# EAGLE design Master_board (EAGLE 8.4.1)
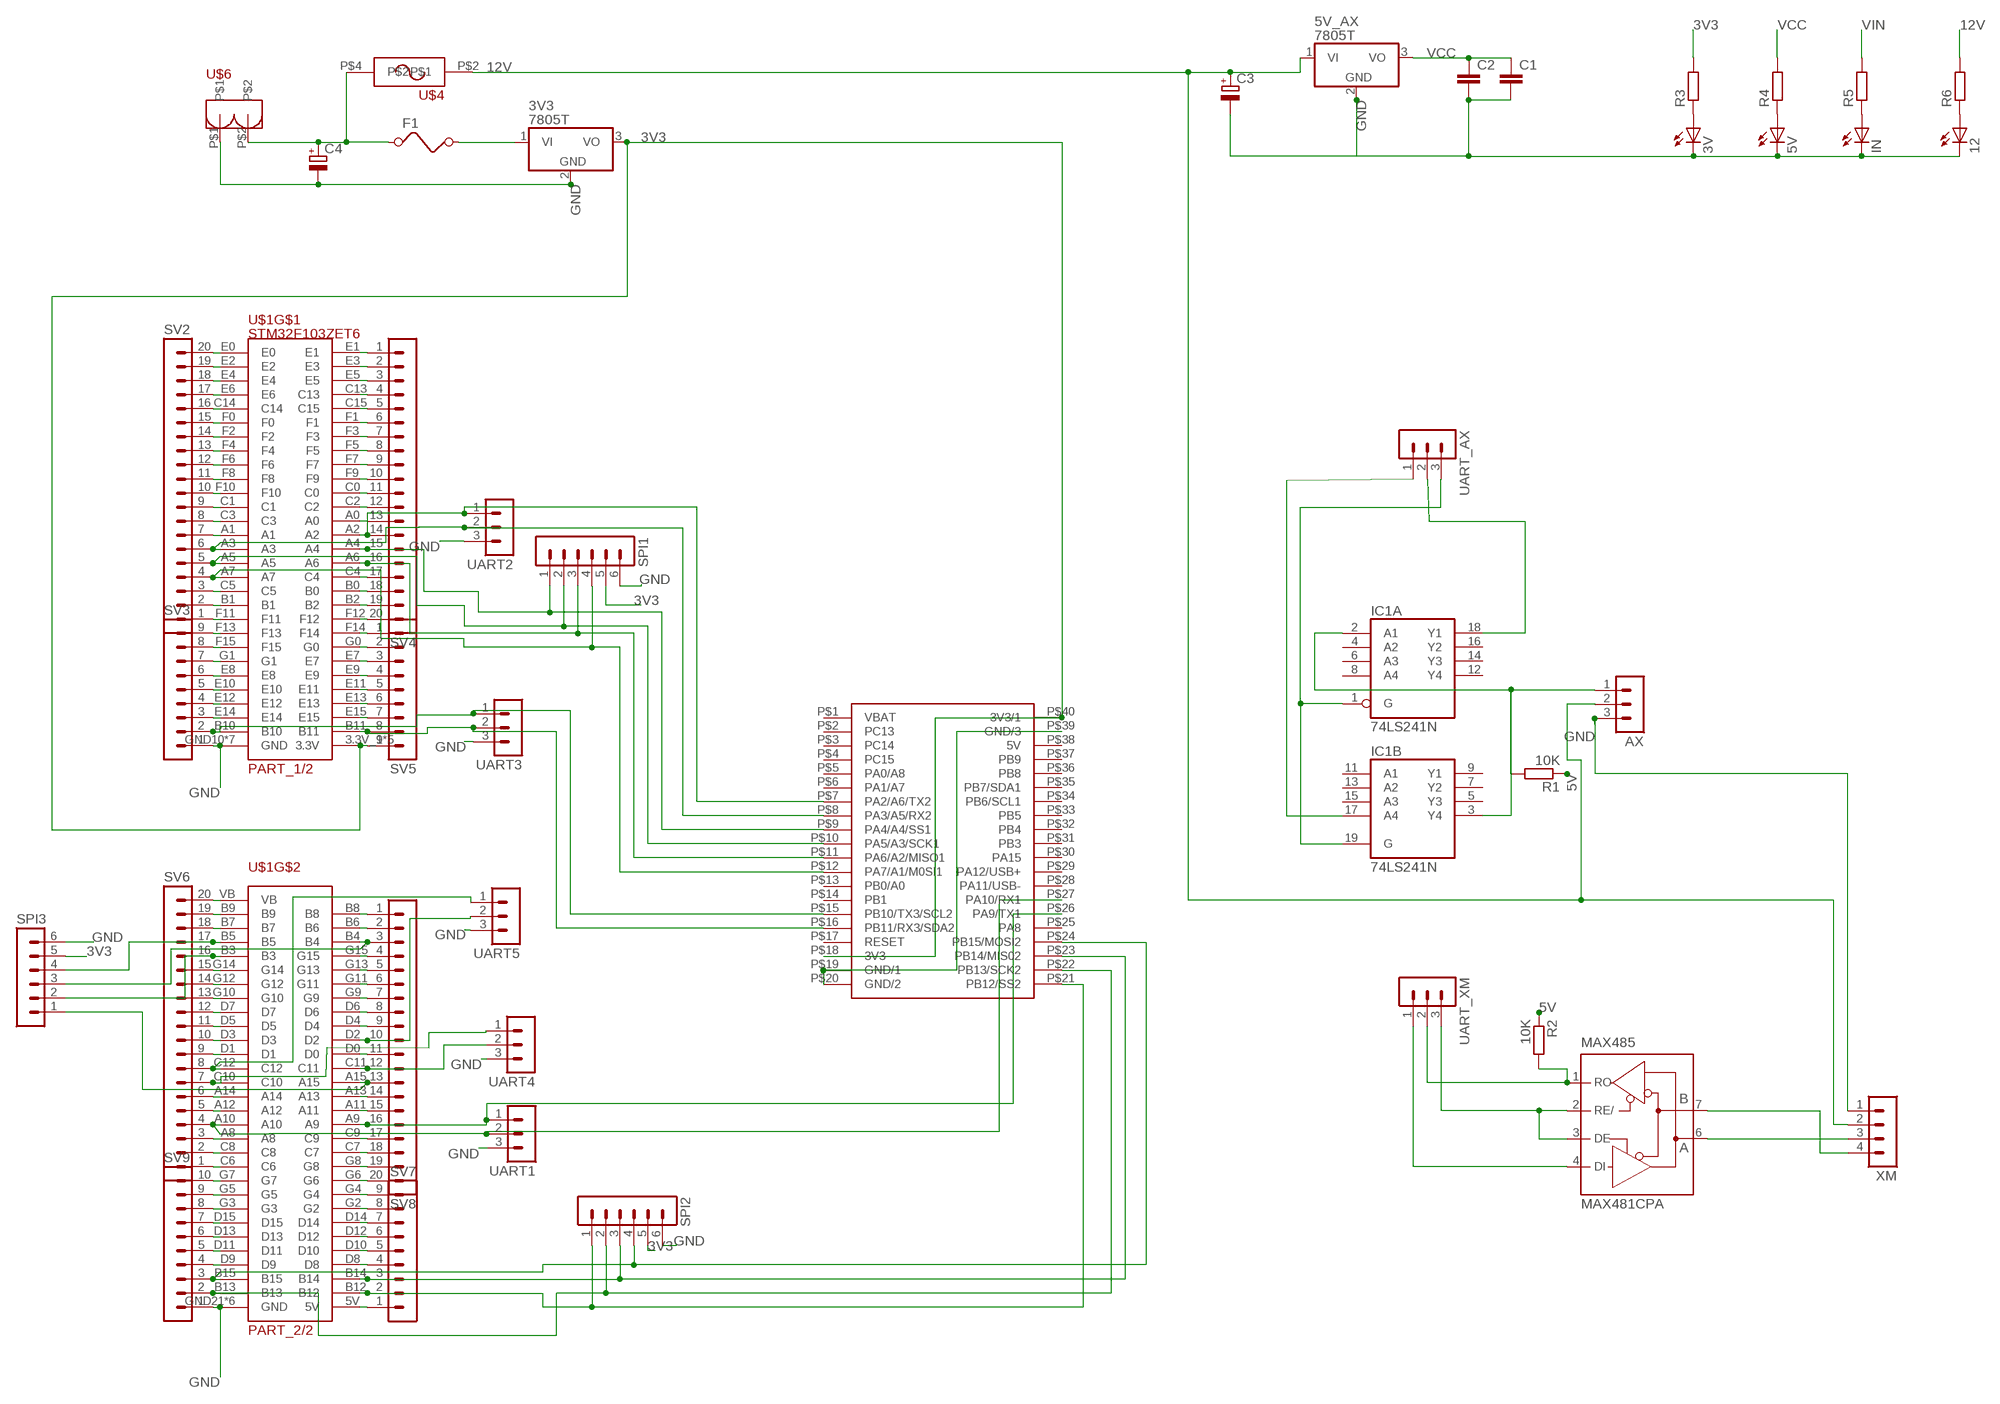
[diagram p0: schematic, sheet 1]

## Parts
3V  LED_ELD260  [LED_LD260]
3V3  7805T  [TO220H]
5V  LED_ELD260  [LED_LD260]
5V_AX  7805T  [TO220H]
12  LED_ELD260  [LED_LD260]
AX  MA03-1  [MA03-1]
C1  C-EU025-024X044  [C025-024X044]
C2  C-EU025-024X044  [C025-024X044]
C3  CPOL-EUE5-10.5  [E5-10,5]
C4  CPOL-EUE5-10.5  [E5-10,5]
F1  FUSE  [FUSE]
IC1  74LS241N  [DIL20]
IN  LED_ELD260  [LED_LD260]
MAX485  MAX481CPA  [DIL08]
R1  10K  R-EU_0309/12  [0309/12]
R2  10K  R-EU_0309/12  [0309/12]
R3  R-EU_0204/5  [0204/5]
R4  R-EU_0204/5  [0204/5]
R5  R-EU_0204/5  [0204/5]
R6  R-EU_0204/5  [0204/5]
SPI1  MA06-1  [MA06-1]
SPI2  MA06-1  [MA06-1]
SPI3  MA06-1  [MA06-1]
SV2  MA20-1L  [MA20-1L]
SV3  MA09-1  [MA09-1]
SV4  MA20-1L  [MA20-1L]
SV5  MA09-1  [MA09-1]
SV6  MA20-1L  [MA20-1L]
SV7  MA09-1  [MA09-1]
SV8  MA20-1L  [MA20-1L]
SV9  MA10-1  [MA10-1]
U$1  M32F103ZET6_DEV_BOARD  [STM32F103ZET6_DEV_BOARD]
U$2  BLUEPILL  [BLUEPILL]
U$4  AUTO_FUSE  [AUTO_FUSE]
U$6  GREEN_HEADER  [GREEN_HEADER]
UART1  MA03-1  [MA03-1]
UART2  MA03-1  [MA03-1]
UART3  MA03-1  [MA03-1]
UART4  MA03-1  [MA03-1]
UART5  MA03-1  [MA03-1]
UART_AX  MA03-1  [MA03-1]
UART_XM  MA03-1  [MA03-1]
XM  MA04-1  [MA04-1]

## Nets
3V3: 3V3.3(VO) R3.2 SPI1.5 SPI2.5 SPI3.5 SV5.9 U$1.3.3V_1(3.3V) U$1.3.3V_2(3.3V) U$1.3.3V_3(3.3V) U$1.3.3V_4(3.3V) U$1.3.3V_5(3.3V) U$2.P$18(3V3) U$2.P$40(3V3/1)
5V: R1.1 R2.1
12V: 5V_AX.1(VI) AX.2 C3.+ R6.2 U$4.P$2 XM.2
CTRL_AX: IC1.1(A:G) IC1.19(B:G) UART_AX.3
CTRL_XM: MAX485.2(RE/) MAX485.3(DE) UART_XM.3
D+: MAX485.6(A) XM.3
D-: MAX485.7(B) XM.4
DATA_AX: AX.1 IC1.2(A:A1) IC1.3(B:Y4) R1.2
GND: 3V3.2(GND) 3V.K(C) 5V.K(C) 5V_AX.2(GND) 12.K(C) AX.3 C1.2 C2.2 C3.- C4.- IN.K(C) SPI1.6 SPI2.6 SPI3.6 SV3.1 SV9.1 U$1.GND10(GND) U$1.GND11(GND) U$1.GND12(GND) U$1.GND13(GND) U$1.GND14(GND) U$1.GND15(GND) U$1.GND16(GND) U$1.GND21(GND) U$1.GND22(GND) U$1.GND24(GND) U$1.GND25(GND) U$1.GND26(GND) U$1.GND_20(GND) U$2.P$19(GND/1) U$2.P$20(GND/2) U$2.P$39(GND/3) U$6.P$1 UART1.3 UART2.3 UART3.3 UART4.3 UART5.3 XM.1
MISO1: SPI1.3 SV4.16 U$1.A6 U$2.P$11(PA6/A2/MISO1)
MISO2: SPI2.3 SV7.3 U$1.B14 U$2.P$23(PB14/MIS02)
MISO3: SPI3.3 SV8.3 U$1.B4
MOSI1: SPI1.4 SV2.4 U$1.A7 U$2.P$12(PA7/A1/M0SI1)
MOSI2: SPI2.4 SV9.3 U$1.B15 U$2.P$24(PB15/MOSI2)
MOSI3: SPI3.4 SV6.17 U$1.B5
N$1: 3V.A R3.1
N$2: 5V.A R4.1
N$3: IN.A R5.1
N$4: 12.A R6.1
N$6: SV2.1 U$1.F11
N$26: SV2.2 U$1.B1
N$27: SV2.3 U$1.C5
N$29: SV2.7 U$1.A1
N$30: SV2.8 U$1.C3
N$31: SV2.9 U$1.C1
N$32: SV2.10 U$1.F10
N$33: SV2.11 U$1.F8
N$34: SV2.12 U$1.F6
N$35: SV2.13 U$1.F4
N$36: SV2.14 U$1.F2
N$37: SV2.15 U$1.F0
N$38: SV2.16 U$1.C14
N$39: SV2.17 U$1.E6
N$40: SV2.18 U$1.E4
N$41: SV2.19 U$1.E2
N$42: SV2.20 U$1.E0
N$44: SV3.3 U$1.E14
N$45: SV3.4 U$1.E12
N$46: SV3.5 U$1.E10
N$47: SV3.6 U$1.E8
N$48: SV3.7 U$1.G1
N$49: SV3.8 U$1.F15
N$50: SV3.9 U$1.F13
N$51: SV4.1 U$1.E1
N$52: SV4.2 U$1.E3
N$53: SV4.3 U$1.E5
N$54: SV4.4 U$1.C13
N$55: SV4.5 U$1.C15
N$56: SV4.6 U$1.F1
N$57: SV4.7 U$1.F3
N$58: SV4.8 U$1.F5
N$59: SV4.9 U$1.F7
N$60: SV4.10 U$1.F9
N$61: SV4.11 U$1.C0
N$62: SV4.12 U$1.C2
N$63: SV4.13 U$1.A0
N$64: SV4.17 U$1.C4
N$65: SV4.18 U$1.B0
N$66: SV4.19 U$1.B2
N$67: SV4.20 U$1.F12
N$68: SV5.1 U$1.F14
N$69: SV5.2 U$1.G0
N$70: SV5.3 U$1.E7
N$71: SV5.4 U$1.E9
N$72: SV5.5 U$1.E11
N$73: SV5.6 U$1.E13
N$74: SV5.7 U$1.E15
N$76: SV6.1 U$1.C6
N$77: SV6.2 U$1.C8
N$78: SV6.3 U$1.A8
N$79: SV6.5 U$1.A12
N$80: SV6.6 U$1.A14
N$81: SV6.9 U$1.D1
N$82: SV6.10 U$1.D3
N$83: SV6.11 U$1.D5
N$84: SV6.12 U$1.D7
N$85: SV6.13 U$1.G10
N$86: SV6.14 U$1.G12
N$87: SV6.15 U$1.G14
N$88: SV6.18 U$1.B7
N$89: SV6.19 U$1.B9
N$90: SV6.20 U$1.VB
N$91: SV7.1 U$1.5V
N$92: SV7.4 U$1.D8
N$93: SV7.5 U$1.D10
N$94: SV7.6 U$1.D12
N$95: SV7.7 U$1.D14
N$96: SV7.8 U$1.G2
N$97: SV7.9 U$1.G4
N$98: SV8.1 U$1.B8
N$99: SV8.2 U$1.B6
N$100: SV8.4 U$1.G15
N$101: SV8.5 U$1.G13
N$102: SV8.6 U$1.G11
N$103: SV8.7 U$1.G9
N$104: SV8.8 U$1.D6
N$105: SV8.9 U$1.D4
N$106: SV8.11 U$1.D0
N$107: SV8.14 U$1.A13
N$108: SV8.15 U$1.A11
N$109: SV8.17 U$1.C9
N$110: SV8.18 U$1.C7
N$111: SV8.19 U$1.G8
N$112: SV8.20 U$1.G6
N$114: SV9.4 U$1.D9
N$115: SV9.5 U$1.D11
N$116: SV9.6 U$1.D13
N$117: SV9.7 U$1.D15
N$118: SV9.8 U$1.G3
N$119: SV9.9 U$1.G5
N$120: SV9.10 U$1.G7
N$121: 3V3.1(VI) F1.2
NSS1: SPI1.1 SV4.15 U$1.A4 U$2.P$9(PA4/A4/SS1)
NSS2: SPI2.1 SV7.2 U$1.B12 U$2.P$21(PB12/SS2)
NSS3: SPI3.1 SV8.13 U$1.A15
RX1: SV6.4 U$1.A10 U$2.P$27(PA10/RX1) UART1.2
RX2: SV2.6 U$1.A3 U$2.P$8(PA3/A5/RX2) UART2.2
RX3: SV5.8 U$1.B11 U$2.P$16(PB11/RX3/SDA2) UART3.2
RX4: SV8.12 U$1.C11 UART4.2
RX5: SV8.10 U$1.D2 UART5.2
RX_AX: IC1.18(A:Y1) UART_AX.2
RX_XM: MAX485.1(RO) R2.2 UART_XM.2
SCK1: SPI1.2 SV2.5 U$1.A5 U$2.P$10(PA5/A3/SCK1)
SCK2: SPI2.2 SV9.2 U$1.B13 U$2.P$22(PB13/SCK2)
SCK3: SPI3.2 SV6.16 U$1.B3
TX1: SV8.16 U$1.A9 U$2.P$26(PA9/TX1) UART1.1
TX2: SV4.14 U$1.A2 U$2.P$7(PA2/A6/TX2) UART2.1
TX3: SV3.2 U$1.B10 U$2.P$15(PB10/TX3/SCL2) UART3.1
TX4: SV6.7 U$1.C10 UART4.1
TX5: SV6.8 U$1.C12 UART5.1
TX_AX: IC1.17(B:A4) UART_AX.1
TX_XM: MAX485.4(DI) UART_XM.1
VCC: 5V_AX.3(VO) C1.1 C2.1 R4.2
VIN: C4.+ F1.1 R5.2 U$4.P$4 U$6.P$2
Unconnected: IC1.4(A:A2) IC1.5(B:Y3) IC1.6(A:A3) IC1.7(B:Y2) IC1.8(A:A4) IC1.9(B:Y1) IC1.11(B:A1) IC1.12(A:Y4) IC1.13(B:A2) IC1.14(A:Y3) IC1.15(B:A3) IC1.16(A:Y2) U$2.P$1(VBAT) U$2.P$2(PC13) U$2.P$3(PC14) U$2.P$4(PC15) U$2.P$5(PA0/A8) U$2.P$6(PA1/A7) U$2.P$13(PB0/A0) U$2.P$14(PB1) U$2.P$17(RESET) U$2.P$25(PA8) U$2.P$28(PA11/USB-) U$2.P$29(PA12/USB+) U$2.P$30(PA15) U$2.P$31(PB3) U$2.P$32(PB4) U$2.P$33(PB5) U$2.P$34(PB6/SCL1) U$2.P$35(PB7/SDA1) U$2.P$36(PB8) U$2.P$37(PB9) U$2.P$38(5V)

## Power pins joined to a net without a drawn wire
GND: IC1.10(P:GND) MAX485.5(GND)
VCC: IC1.20(P:VCC) MAX485.8(VCC)

## Library data of the parts
3V 5V 12 IN = eagle-ltspice:LED_E: LED Source: http://www.osram.convergy.de Source: www.luxeon.com Source: www.kingbright.com; SPICEMODEL: NONE; SPICEPREFIX: D; SPICETYPE: diode
3V3 5V_AX = linear:78*: Positive VOLTAGE REGULATOR Source: http://cache.national.com/ds/LM/LM78L05.pdf http://www.fairchildsemi.com/ds/LM/LM7805.pdf
AX UART1-UART5 UART_AX UART_XM = con-lstb:MA03-1: PIN HEADER; OC_FARNELL: unknown; OC_NEWARK: unknown
C1 C2 = rcl:C-EU: CAPACITOR, European symbol
C3 C4 = rcl:CPOL-EU: POLARIZED CAPACITOR, European symbol
F1 = special:FUSE: FUSE 5 x 20 mm
IC1 = 74xx-eu:74*241: Octal BUFFER and LINE DRIVER, 3-state
MAX485 = maxim:MAX481CPA: RS485 TRANSEIVER; MPN: MAX481CPA+; OC_FARNELL: unknown; OC_NEWARK: 99K3445
R1 R2 = rcl:R-EU_: RESISTOR, European symbol
R3-R6 = resistor:R-EU_: RESISTOR, European symbol
SPI1-SPI3 = con-lstb:MA06-1: PIN HEADER; OC_FARNELL: unknown; OC_NEWARK: unknown
SV2 SV4 SV6 SV8 = con-lstb:MA20-1L: PIN HEADER; OC_FARNELL: unknown; OC_NEWARK: unknown
SV3 SV5 SV7 = con-lstb:MA09-1: PIN HEADER; OC_FARNELL: unknown; OC_NEWARK: unknown
SV9 = con-lstb:MA10-1: PIN HEADER; OC_FARNELL: unknown; OC_NEWARK: unknown
U$1 = STM32F103ZET6_dev_board:M32F103ZET6_DEV_BOARD: Model : Vcc-gnd.com_STM32F103ZET6 Source : http://wiki.stm32duino.com/index.php?title=Vcc-gnd.com_STM32F103ZET6 Created by Florenc Caminade Date 08/01/2018
U$2 = stm32duino boards:BLUEPILL
U$4 = AUTO_FUSE:AUTO_FUSE
U$6 = PowerHeaders:GREEN_HEADER: Green Connector for PCB Drill: 1.5mm Diameter: 3.81mm Pitch: 5.08mm //FCAM1
XM = con-lstb:MA04-1: PIN HEADER; OC_FARNELL: unknown; OC_NEWARK: unknown

## Board
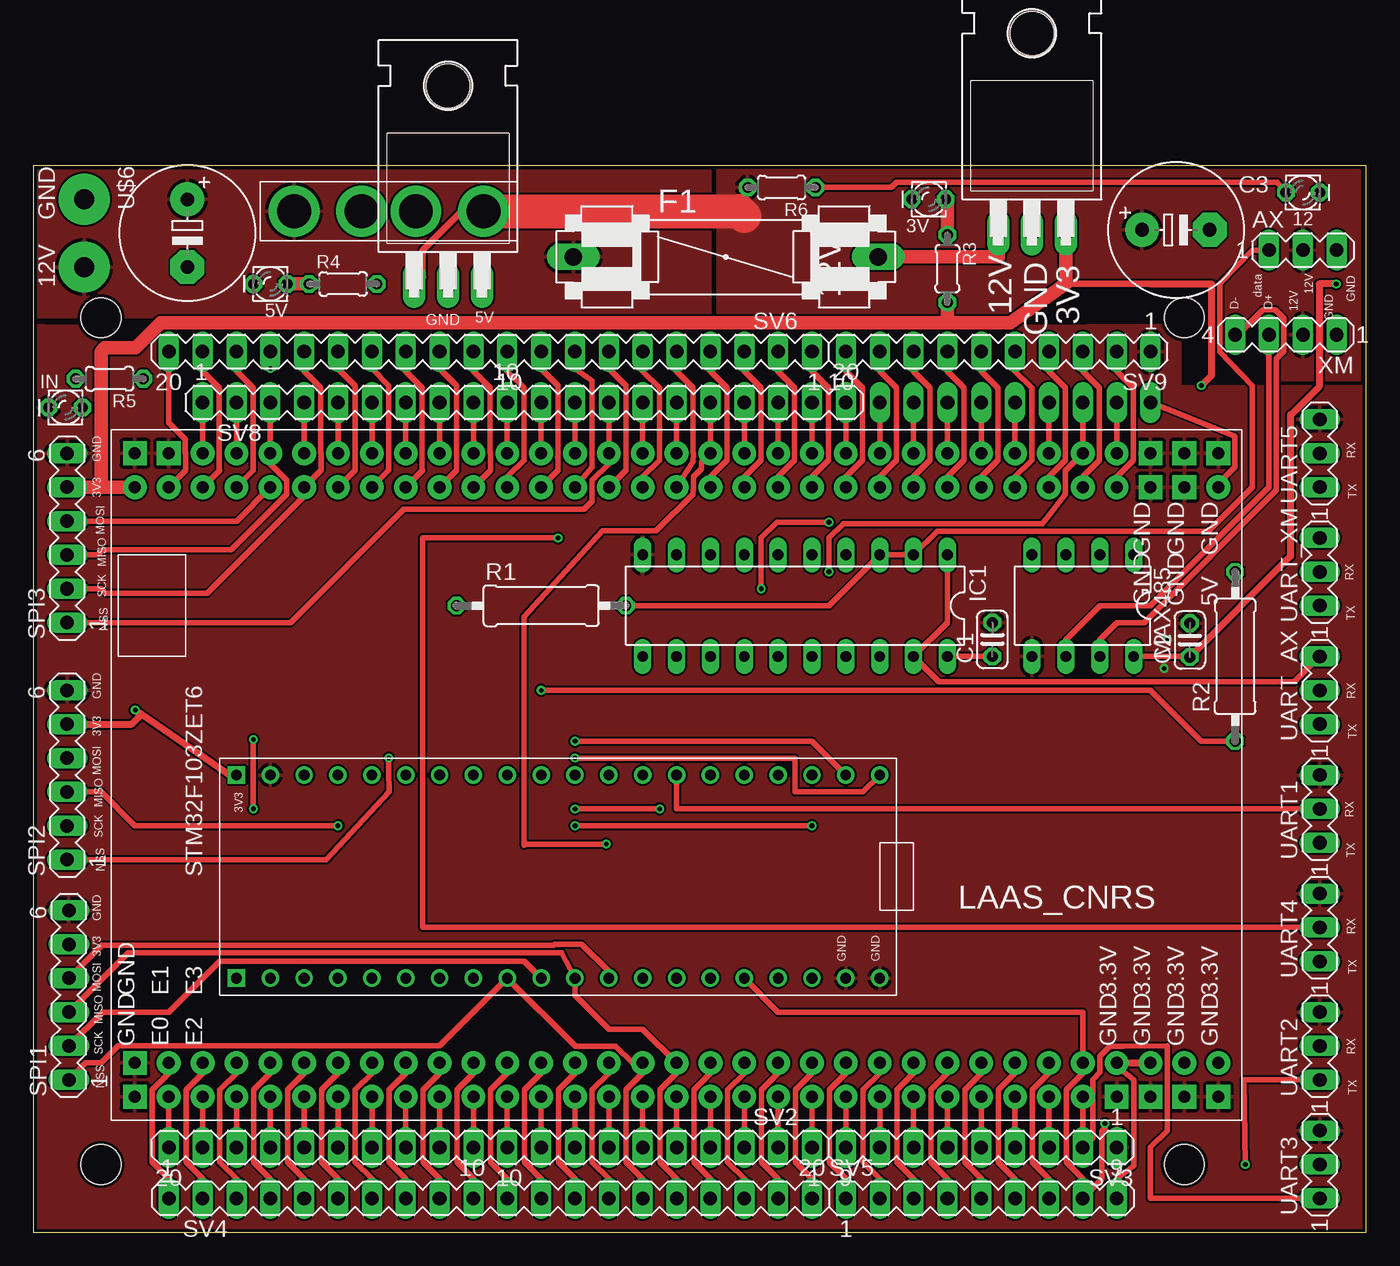
[diagram p1: board, top side]
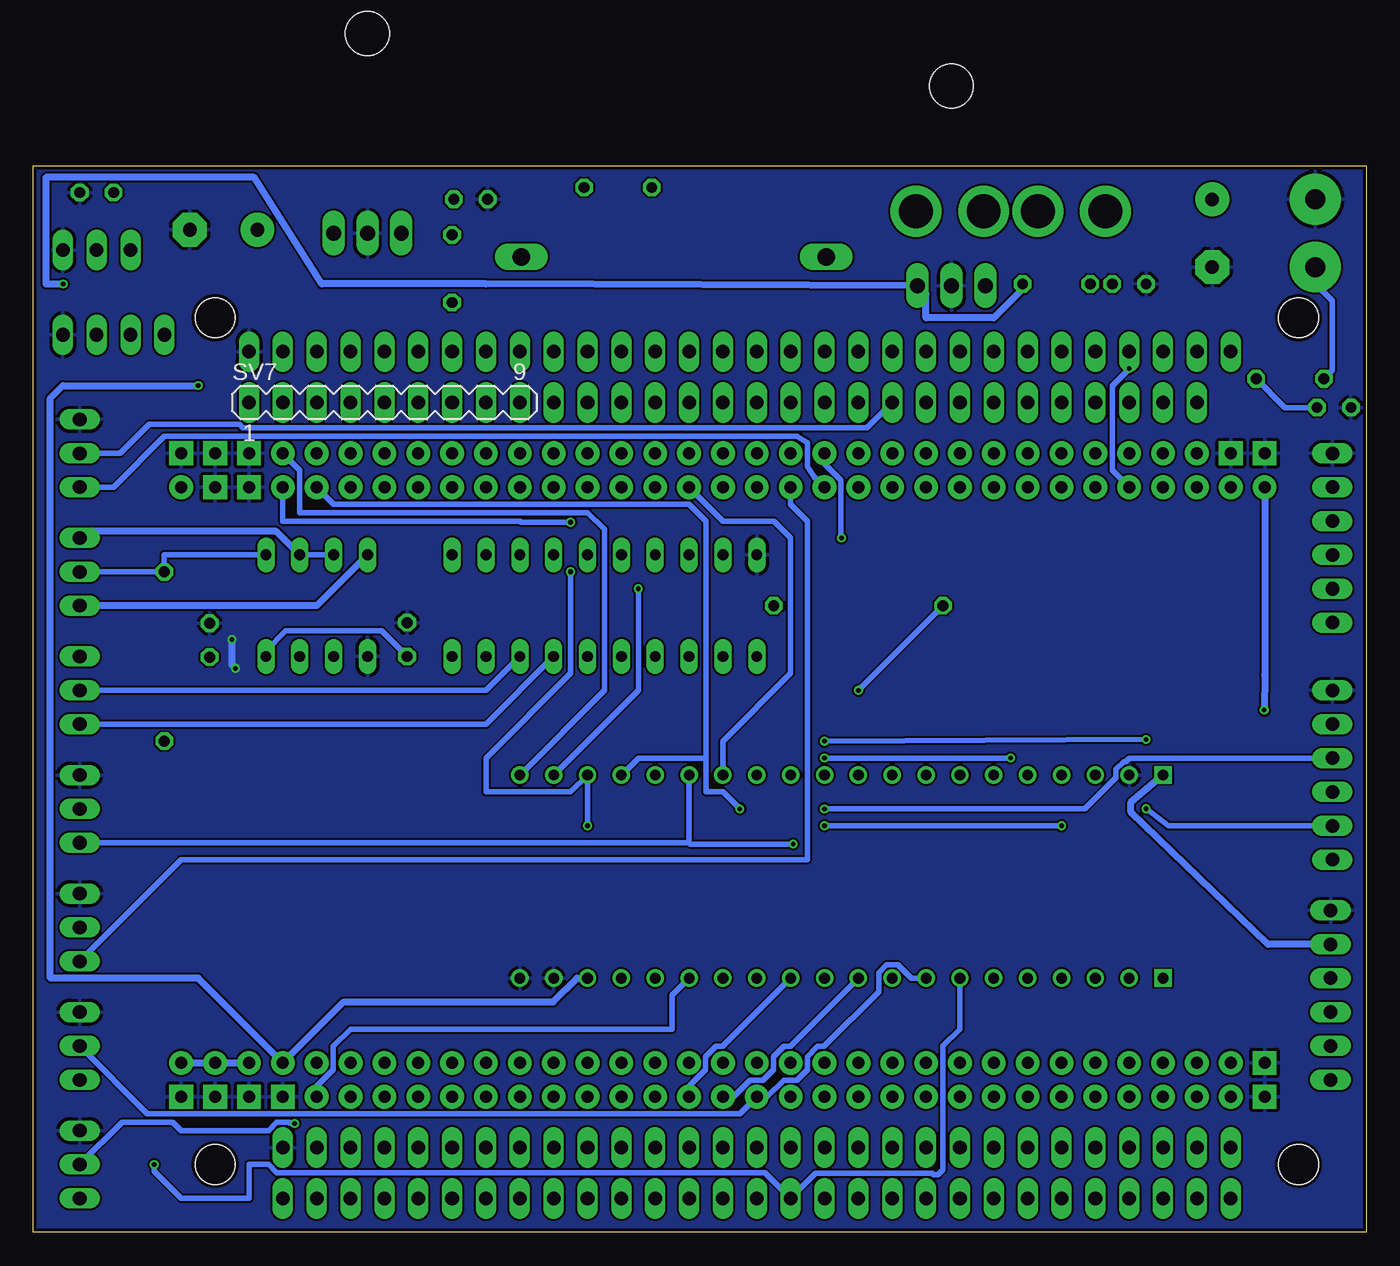
[diagram p2: board, bottom side, seen from below]

Size 100 x 80 mm. Coordinates in mm from the lower left corner, seen from the top.
Outline: 0,0 100,0 100,80 0,80 0,0
Copper layers (1*16): Top 0.035mm / dielectric 1.5mm / Bottom 0.035mm
Design rules "SeeedStudio_2layer_DRU_no_angle_20140221": minimum track width 6mil, minimum drill 12mil, track to track 6mil, track to pad 6mil, pad to pad 6mil, via to via 6mil, smd to smd 0mil, copper to edge 10mil, drill to drill 10mil, minimum pad ring 10mil, minimum via ring 6mil, stop-mask expansion 2mil, vias tented up to drill 100mil, thermal gap 10mil

### Footprints (pad centres in the part's own frame; a part is rotated, then mirrored left to right if it is on the bottom)
LED_LD260 = drill 0.813 octagon: A -1.27,0; K 1.27,0
TO220H = drill 1.118 long: 1 -2.54,-10.16; 2 0,-10.16; 3 2.54,-10.16 | hole 3.302: 0,4.826
MA03-1 = drill 1.016 long: 1 -2.54,0; 2 0,0; 3 2.54,0
C025-024X044 = drill 0.813 octagon: 1 -1.27,0; 2 1.27,0
E5-10,5 = drill 1.016 pad 2.54: + -2.54,0 | drill 1.016 pad 2.54 octagon: - 2.54,0
FUSE = drill 1.321 long: 1 -11.43,0; 2 11.43,0
DIL20 = drill 0.813 long: 1 -11.43,-3.81; 2 -8.89,-3.81; 3 -6.35,-3.81; 4 -3.81,-3.81; 5 -1.27,-3.81; 6 1.27,-3.81; 7 3.81,-3.81; 8 6.35,-3.81; 9 8.89,-3.81; 10 11.43,-3.81; 11 11.43,3.81; 12 8.89,3.81; 13 6.35,3.81; 14 3.81,3.81; 15 1.27,3.81; 16 -1.27,3.81; 17 -3.81,3.81; 18 -6.35,3.81; 19 -8.89,3.81; 20 -11.43,3.81
DIL08 = drill 0.813 long: 1 -3.81,-3.81; 2 -1.27,-3.81; 3 1.27,-3.81; 4 3.81,-3.81; 5 3.81,3.81; 6 1.27,3.81; 7 -1.27,3.81; 8 -3.81,3.81
0309/12 = drill 0.813 octagon: 1 -6.35,0; 2 6.35,0
0204/5 = drill 0.813 octagon: 1 -2.54,0; 2 2.54,0
MA06-1 = drill 1.016 long: 1 -6.35,0; 2 -3.81,0; 3 -1.27,0; 4 1.27,0; 5 3.81,0; 6 6.35,0
MA20-1L = drill 1.016 long: 1 24.13,0; 2 21.59,0; 3 19.05,0; 4 16.51,0; 5 13.97,0; 6 11.43,0; 7 8.89,0; 8 6.35,0; 9 3.81,0; 10 1.27,0; 11 -1.27,0; 12 -3.81,0; 13 -6.35,0; 14 -8.89,0; 15 -11.43,0; 16 -13.97,0; 17 -16.51,0; 18 -19.05,0; 19 -21.59,0; 20 -24.13,0
MA09-1 = drill 1.016 long: 1 -10.16,0; 2 -7.62,0; 3 -5.08,0; 4 -2.54,0; 5 0,0; 6 2.54,0; 7 5.08,0; 8 7.62,0; 9 10.16,0
MA10-1 = drill 1.016 long: 1 -11.43,0; 2 -8.89,0; 3 -6.35,0; 4 -3.81,0; 5 -1.27,0; 6 1.27,0; 7 3.81,0; 8 6.35,0; 9 8.89,0; 10 11.43,0
STM32F103ZET6_DEV_BOARD = drill 0.9 pad 1.778: 3.3V_1 -21.59,-33.02; 3.3V_2 -21.59,-35.56; 3.3V_3 -21.59,-38.1; 3.3V_4 -21.59,-40.64; 3.3V_5 21.59,40.64; 5V 21.59,-40.64; A0 -21.59,7.62; A1 -24.13,5.08; A2 -21.59,5.08; A3 -24.13,2.54; A4 -21.59,2.54; A5 -24.13,0; A6 -21.59,0; A7 -24.13,-2.54; A8 21.59,-5.08; A9 24.13,-2.54; A10 21.59,-2.54; A11 24.13,0; A12 21.59,0; A13 24.13,2.54; A14 21.59,2.54; A15 24.13,5.08; B0 -21.59,-5.08; B1 -24.13,-7.62; B2 -21.59,-7.62; B3 21.59,27.94; B4 24.13,30.48; B5 21.59,30.48; B6 24.13,33.02; B7 21.59,33.02; B8 24.13,35.56; B9 21.59,35.56; B10 -24.13,-30.48; B11 -21.59,-30.48; B12 24.13,-33.02; B13 21.59,-33.02; B14 24.13,-30.48; B15 21.59,-30.48; C0 -21.59,12.7; C1 -24.13,10.16; C2 -21.59,10.16; C3 -24.13,7.62; C4 -21.59,-2.54; C5 -24.13,-5.08; C6 21.59,-10.16; C7 24.13,-7.62; C8 21.59,-7.62; C9 24.13,-5.08; C10 21.59,5.08; C11 24.13,7.62; C12 21.59,7.62; C13 -21.59,30.48; C14 -24.13,27.94; C15 -21.59,27.94; D0 24.13,10.16; D1 21.59,10.16; D2 24.13,12.7; D3 21.59,12.7; D4 24.13,15.24; D5 21.59,15.24; D6 24.13,17.78; D7 21.59,17.78; D8 24.13,-27.94; D9 21.59,-27.94; D10 24.13,-25.4; D11 21.59,-25.4; D12 24.13,-22.86; D13 21.59,-22.86; D14 24.13,-20.32; D15 21.59,-20.32; E0 -24.13,38.1; E1 -21.59,38.1; E2 -24.13,35.56; E3 -21.59,35.56; E4 -24.13,33.02; E5 -21.59,33.02; E6 -24.13,30.48; E7 -21.59,-17.78; E8 -24.13,-20.32; E9 -21.59,-20.32; E10 -24.13,-22.86; E11 -21.59,-22.86; E12 -24.13,-25.4; E13 -21.59,-25.4; E14 -24.13,-27.94; E15 -21.59,-27.94; F0 -24.13,25.4; F1 -21.59,25.4; F2 -24.13,22.86; F3 -21.59,22.86; F4 -24.13,20.32; F5 -21.59,20.32; F6 -24.13,17.78; F7 -21.59,17.78; F8 -24.13,15.24; F9 -21.59,15.24; F10 -24.13,12.7; F11 -24.13,-10.16; F12 -21.59,-10.16; F13 -24.13,-12.7; F14 -21.59,-12.7; F15 -24.13,-15.24; G0 -21.59,-15.24; G1 -24.13,-17.78; G2 24.13,-17.78; G3 21.59,-17.78; G4 24.13,-15.24; G5 21.59,-15.24; G6 24.13,-12.7; G7 21.59,-12.7; G8 24.13,-10.16; G9 24.13,20.32; G10 21.59,20.32; G11 24.13,22.86; G12 21.59,22.86; G13 24.13,25.4; G14 21.59,25.4; G15 24.13,27.94; VB 21.59,38.1 | drill 0.9 pad 1.778 square: GND10 -24.13,40.64; GND11 -24.13,-33.02; GND12 -24.13,-35.56; GND13 -24.13,-38.1; GND14 -24.13,-40.64; GND15 21.59,-35.56; GND16 21.59,-38.1; GND21 24.13,40.64; GND22 24.13,38.1; GND24 24.13,-35.56; GND25 24.13,-38.1; GND26 24.13,-40.64; GND_20 -21.59,40.64
BLUEPILL = drill 0.8 square: P$1 -7.62,22.86; P$40 7.62,22.86 | drill 0.8: P$2 -7.62,20.32; P$3 -7.62,17.78; P$4 -7.62,15.24; P$5 -7.62,12.7; P$6 -7.62,10.16; P$7 -7.62,7.62; P$8 -7.62,5.08; P$9 -7.62,2.54; P$10 -7.62,0; P$11 -7.62,-2.54; P$12 -7.62,-5.08; P$13 -7.62,-7.62; P$14 -7.62,-10.16; P$15 -7.62,-12.7; P$16 -7.62,-15.24; P$17 -7.62,-17.78; P$18 -7.62,-20.32; P$19 -7.62,-22.86; P$20 -7.62,-25.4; P$21 7.62,-25.4; P$22 7.62,-22.86; P$23 7.62,-20.32; P$24 7.62,-17.78; P$25 7.62,-15.24; P$26 7.62,-12.7; P$27 7.62,-10.16; P$28 7.62,-7.62; P$29 7.62,-5.08; P$30 7.62,-2.54; P$31 7.62,0; P$32 7.62,2.54; P$33 7.62,5.08; P$34 7.62,7.62; P$35 7.62,10.16; P$36 7.62,12.7; P$37 7.62,15.24; P$38 7.62,17.78; P$39 7.62,20.32
AUTO_FUSE = drill 2.54 pad 3.81: P$1 -2.03,0; P$2 -7.11,0; P$3 2.03,0; P$4 7.11,0
TROUS_FIXATION = hole 3: 5.08,5.08; 5.08,68.58; 86.36,68.58; 86.36,5.08
GREEN_HEADER = drill 1.5 pad 3.81: P$1 -2.54,0; P$2 2.54,0
MA04-1 = drill 1.016 long: 1 -3.81,0; 2 -1.27,0; 3 1.27,0; 4 3.81,0

### Placement (x,y rotation side)
3V  67.18,77.47 180 top
3V3  74.93,85.09 0 top
5V  17.78,71.12 180 top
5V_AX  31.11,81.15 0 top
12  95.25,77.98 0 top
AX  95.25,73.66 0 top
C1  71.95,44.45 90 top
C2  86.77,44.4 90 top
C3  85.72,75.18 0 top
C4  11.56,74.93 270 top
F1  51.94,73.15 0 top
IC1  57.15,46.99 180 top
IN  2.41,61.85 180 top
MAX485  78.74,46.99 180 top
R1  38.1,46.99 0 top
R2  90.17,43.18 90 top
R3  68.58,72.26 270 top
R4  23.24,71.12 0 top
R5  5.71,64.01 180 top
R6  56.13,78.36 180 top
SPI1  2.67,17.78 90 top
SPI2  2.54,34.29 90 top
SPI3  2.54,52.07 90 top
SV2  34.29,6.35 0 top
SV3  71.12,6.35 180 top
SV4  34.29,2.54 180 top
SV5  71.12,2.54 0 top
SV6  34.29,66.04 0 top
SV7  73.66,62.23 0 bottom
SV8  36.83,62.23 180 top
SV9  72.39,66.04 180 top
U$1  48.26,34.29 90 top
U$2  38.1,26.67 90 top
U$4  26.67,76.58 180 top
U$5  [TROUS_FIXATION]  0,0 0 top
U$6  3.81,74.93 270 top
UART1  96.52,31.75 90 top
UART2  96.52,13.97 90 top
UART3  96.52,5.08 90 top
UART4  96.52,22.86 90 top
UART5  96.52,58.42 90 top
UART_AX  96.52,40.64 90 top
UART_XM  96.52,49.53 90 top
XM  93.98,67.31 180 top

### Tracks (layer width: path | path; a pad name or v marks a point on that pad's centre or on a via)
3V3  (via drill 0.35)
  Top 0.406: U$1.3.3V_1 81.28,12.44 82.58,11.45 82.58,5 81.28,4.01 SV5.9
  Top 0.508: U$1.3.3V_1 U$1.3.3V_2 | 8.12,38.83 v7.65,39.16 | 8.12,38.83 15.03,34.08 U$2.P$40 | 77.47,71.12 83.83,71.11 88.42,71.11 88.42,66.05 88.41,65.8 88.41,64.28 v87.63,63.5 | SPI2.5 7.39,38.1 8.12,38.83
  Top 1.016: SPI3.5 5.08,55.88 | 5.08,55.88 U$1.3.3V_5 | 5.08,55.88 5.08,66.04 5.36,66.32 7.66,66.32 9.57,68.22 37.06,68.22 37.08,68.2 37.48,68.2 37.51,68.22 68.58,68.22 | 68.58,68.22 73.3,68.22 77.47,71.12 3V3.3 | R3.2 68.58,68.22
  Bottom 0.508: v87.63,63.5 97.79,63.5 98.73,62.56 98.73,19.05 87.63,19.05 U$1.3.3V_1 76.71,17.27 60.99,17.27 59.22,19.05 U$2.P$18 | U$1.3.3V_5 7.62,41.79 v7.65,39.16 | U$1.3.3V_2 U$1.3.3V_3 U$1.3.3V_4 | SPI1.5 7.37,21.59 17.65,31.5 17.65,32.26 U$2.P$40
5V  (via drill 0.35)
  Top 0.406: v38.1,40.64 83.82,40.64 87.63,36.83 R2.1
  Bottom 0.406: R1.1 v38.1,40.64
12V
  Top 0.508: 5V_AX.1 29.21,71.63 29.21,73.66 32.13,76.58 U$4.P$2
  Top 2.54: U$4.P$2 52.96,76.58 53.34,76.2
  pour Top: 51.31,79.76 51.31,68.58 86.49,68.58 86.49,63.88 99.57,63.88 99.57,79.63 97.28,79.63
CTRL_AX
  Top 0.406: IC1.1 68.58,45.72 IC1.19 67.94,41.27 94.61,41.27 UART_AX.3
CTRL_XM
  Bottom 0.406: MAX485.3 MAX485.2
  Bottom 0.508: MAX485.2 81.78,52.57 96.02,52.57 UART_XM.3
D+
  Top 0.406: MAX485.6 77.47,44.45 80.01,46.99 83.82,46.99 92.71,55.88 XM.3
D-
  Top 0.406: MAX485.7 80.01,44.45 81.28,45.72 83.34,45.72 93.27,55.65 93.27,65.53 93.83,66.08 93.83,68.53 93.17,69.19 92.25,69.19 90.37,67.31 XM.4
DATA_AX
  Top 0.406: R1.2 59.69,46.99 IC1.3 IC1.2 67.82,52.58 88.14,52.58 91.44,55.88 91.44,63.5 89.03,66.04 89.03,71.12 91.44,73.66 AX.1
GND  (via drill 0.35)
  Bottom 0.508: v84.84,42.29 85.09,42.55 v85.09,44.45
  pour Bottom: 0.12,79.82 0.12,0.27 99.82,0.27 99.82,79.83 0.13,79.83
  pour Top: 0.13,68.01 0.13,0.27 99.83,0.27 99.7,63.44 86.11,63.44 86.11,68.07 50.8,67.88 48.77,67.94 0.9,68.01
MISO1
  Top 0.406: SV4.16 48.26,4.01 47.02,5.25 47.02,10.68 48.26,11.92 U$1.A6 45.72,15.24 43.18,15.24 40.64,17.78 U$2.P$11 39.62,20.95 7.11,20.95 SPI1.3
MISO2  (via drill 0.35)
  Top 0.406: v40.64,30.48 v58.42,30.48 | SV7.3 U$1.B14 78,57.68 78,57.67 77.44,57.11 77.44,55.36 76,53.49 | 76,53.49 75.72,53.14 | v59.69,49.53 59.69,52.07 60.77,53.15 75.66,53.15 76,53.49 | v22.86,30.48 7.62,30.48 5.08,33.02 SPI2.3
  Bottom 0.406: v22.86,30.48 v40.64,30.48 | v58.42,30.48 U$2.P$23 59.69,33.02 66.04,33.02 66.04,35.56 59.69,41.91 v59.69,49.53
MISO3
  Top 0.406: SV8.3 U$1.B4 17.78,57.64 19.02,56.4 19.02,55.36 18.3,54.63 | 18.3,54.63 | 18.3,54.63 17.71,54.05 14.85,51.19 5.22,51.19 4.83,50.8 SPI3.3
MOSI1
  Top 0.406: U$1.A7 SV2.4 | SPI1.4 5.13,21.51 39.04,21.51 39.12,21.59 41.15,21.59 43.18,19.56 U$2.P$12
  Bottom 0.406: U$2.P$12 48.28,13.95 48.78,13.95 49.55,13.16 49.55,12.18 50.8,10.94 U$1.A7
MOSI2  (via drill 0.35)
  Top 0.406: v40.64,31.75 v46.99,31.75 | U$1.B15 78.74,56.66 79.98,57.9 79.98,63.33 78.74,64.57 SV9.3
  Bottom 0.406: v40.64,31.75 21.11,31.75 18.79,34.07 18.79,34.71 18.2,35.3 18.04,35.3 17.78,35.56 SPI2.4 | v46.99,31.75 48.26,33.02 49.53,33.02 49.53,35.56 | 49.53,35.56 54.61,35.56 U$2.P$24 | 49.53,35.56 49.53,53.34 50.8,54.61 77.47,54.61 U$1.B15
MOSI3  (via drill 0.35)
  Top 0.406: U$1.B5 15.24,53.34 SPI3.4 | SV6.17 v17.78,64.77
  Bottom 0.406: v17.78,64.77 19.05,63.5 19.05,57.15 U$1.B5
N$1
  Top 1.016: 3V.A 68.58,77.34 R3.1
N$2
  Top 1.016: 5V.A R4.1
N$3
  Bottom 0.406: IN.A 6.1,61.85 R5.1
N$4
  Top 0.406: R6.1 64.39,78.36 64.77,78.74 93.34,78.74 12.A
N$6
  Top 0.406: U$1.F11 SV2.1
N$26
  Top 0.406: U$1.B1 SV2.2
N$27
  Top 0.406: U$1.C5 SV2.3
N$29
  Top 0.406: U$1.A1 SV2.7
N$30
  Top 0.406: U$1.C3 SV2.8
N$31
  Top 0.406: U$1.C1 SV2.9
N$32
  Top 0.406: U$1.F10 SV2.10
N$33
  Top 0.406: U$1.F8 SV2.11
N$34
  Top 0.406: U$1.F6 SV2.12
N$35
  Top 0.406: U$1.F4 SV2.13
N$36
  Top 0.406: U$1.F2 SV2.14
N$37
  Top 0.406: U$1.F0 SV2.15
N$38
  Top 0.406: U$1.C14 SV2.16
N$39
  Top 0.406: U$1.E6 SV2.17
N$40
  Top 0.406: U$1.E4 SV2.18
N$41
  Top 0.406: U$1.E2 SV2.19
N$42
  Top 0.406: U$1.E0 SV2.20
N$44
  Top 0.406: U$1.E14 SV3.3
N$45
  Top 0.406: U$1.E12 SV3.4
N$46
  Top 0.406: U$1.E10 SV3.5
N$47
  Top 0.406: U$1.E8 SV3.6
N$48
  Top 0.406: U$1.G1 SV3.7
N$49
  Top 0.406: U$1.F15 SV3.8
N$50
  Top 0.406: U$1.F13 SV3.9
N$51
  Top 0.406: U$1.E1 10.16,11.92 8.91,10.68 8.91,5.25 10.16,4.01 SV4.1
N$52
  Top 0.406: U$1.E3 12.7,11.92 11.46,10.68 11.46,5.25 12.7,4.01 SV4.2
N$53
  Top 0.406: U$1.E5 15.24,11.92 13.99,10.68 13.99,5.25 15.24,4.01 SV4.3
N$54
  Top 0.406: U$1.C13 17.78,11.92 16.54,10.68 16.54,5.25 17.78,4.01 SV4.4
N$55
  Top 0.406: U$1.C15 20.32,11.92 19.07,10.68 19.07,5.25 20.32,4.01 SV4.5
N$56
  Top 0.406: U$1.F1 22.86,11.92 21.61,10.68 21.61,5.25 22.86,4.01 SV4.6
N$57
  Top 0.406: U$1.F3 25.4,11.92 24.16,10.68 24.16,5.25 25.4,4.01 SV4.7
N$58
  Top 0.406: U$1.F5 27.94,11.92 26.7,10.68 26.7,5.25 27.94,4.01 SV4.8
N$59
  Top 0.406: U$1.F7 30.48,11.92 29.23,10.68 29.23,5.25 30.48,4.01 SV4.9
N$60
  Top 0.406: U$1.F9 33.02,11.92 31.77,10.68 31.77,5.25 33.02,4.01 SV4.10
N$61
  Top 0.406: U$1.C0 35.56,11.92 34.31,10.68 34.31,5.25 35.56,4.01 SV4.11
N$62
  Top 0.406: U$1.C2 38.1,11.92 36.85,10.68 36.85,5.25 38.1,4.01 SV4.12
N$63
  Top 0.406: U$1.A0 40.64,11.92 39.4,10.68 39.4,5.25 40.64,4.01 SV4.13
N$64
  Top 0.406: U$1.C4 50.8,11.92 49.55,10.68 49.55,5.25 50.8,4.01 SV4.17
N$65
  Top 0.406: U$1.B0 53.34,11.92 52.09,10.68 52.09,5.25 53.34,4.01 SV4.18
N$66
  Top 0.406: U$1.B2 55.88,11.92 54.63,10.68 54.63,5.25 55.88,4.01 SV4.19
N$67
  Top 0.406: U$1.F12 58.42,11.92 57.17,10.68 57.17,5.25 58.42,4.01 SV4.20
N$68
  Top 0.406: SV5.1 60.96,4.01 59.72,5.25 59.72,10.68 60.96,11.92 U$1.F14
N$69
  Top 0.406: U$1.G0 63.5,11.92 62.26,10.68 62.26,5.25 63.5,4.01 SV5.2
N$70
  Top 0.406: U$1.E7 66.04,11.92 64.8,10.68 64.8,5.25 66.04,4.01 SV5.3
N$71
  Top 0.406: U$1.E9 68.58,11.92 67.33,10.68 67.33,5.25 68.58,4.01 SV5.4
N$72
  Top 0.406: U$1.E11 71.12,11.92 69.88,10.68 69.88,5.25 71.12,4.01 SV5.5
N$73
  Top 0.406: U$1.E13 73.66,11.92 72.42,10.68 72.42,5.25 73.66,4.01 SV5.6
N$74
  Top 0.406: U$1.E15 76.2,11.92 74.95,10.68 74.95,5.25 76.2,4.01 SV5.7
N$76
  Top 0.406: U$1.C6 58.42,56.66 59.66,57.9 59.66,63.33 58.42,64.57 SV6.1
N$77
  Top 0.406: U$1.C8 55.88,56.66 57.12,57.9 57.12,63.33 55.88,64.57 SV6.2
N$78
  Top 0.406: U$1.A8 53.34,56.66 54.59,57.9 54.59,63.33 53.34,64.57 SV6.3
N$79
  Top 0.406: SV6.5 48.26,64.57 49.51,63.33 49.51,58.45 49.53,58.42 49.49,57.79 U$1.A12
N$80
  Top 0.406: U$1.A14 45.72,56.66 46.97,57.9 46.97,63.33 45.72,64.57 SV6.6
N$81
  Top 0.406: SV6.9 38.1,64.77 39.37,63.5 39.37,58.17 | 39.34,58.14 39.37,58.17 | 39.37,58.17 39.37,57.15 U$1.D1
N$82
  Top 0.406: U$1.D3 35.56,56.66 36.8,57.9 36.8,63.33 35.56,64.57 SV6.10
N$83
  Top 0.406: SV6.11 33.02,64.57 34.27,63.33 34.27,58.45 34.29,58.42 34.29,57.15 U$1.D5
N$84
  Top 0.406: SV6.12 30.48,64.77 31.75,63.5 31.75,57.15 U$1.D7
N$85
  Top 0.406: 27.94,65.14 27.94,64.57 | 27.94,65.14 SV6.13 | U$1.G10 29.21,57.15 29.18,57.17 29.18,63.33 27.94,64.57 | 27.94,64.57 27.94,65.14
N$86
  Top 0.406: SV6.14 25.4,64.77 26.67,63.5 26.67,57.15 U$1.G12
N$87
  Top 0.406: SV6.15 22.86,64.77 24.13,63.5 24.13,57.15 U$1.G14
N$88
  Top 0.406: SV6.18 15.24,64.57 16.48,63.33 16.48,58.45 16.51,58.42 16.51,57.15 U$1.B7
N$89
  Top 0.406: SV6.19 12.7,64.57 13.95,63.33 13.95,57.17 13.97,57.15 U$1.B9
N$90
  Top 0.406: SV6.20 10.16,60.7 11.4,59.46 11.4,58.45 11.43,58.42 11.43,57.15 U$1.VB
N$91
  Top 0.406: U$1.5V 88.9,56.14 90.14,57.38 90.14,59.72 SV7.1
N$92
  Top 0.406: U$1.D8 SV7.4
N$93
  Top 0.406: U$1.D10 SV7.5
N$94
  Top 0.406: U$1.D12 SV7.6
N$95
  Top 0.406: U$1.D14 SV7.7
N$96
  Top 0.406: U$1.G2 SV7.8
N$97
  Top 0.406: SV7.9 U$1.G4
N$98
  Top 0.406: SV8.1 U$1.B8
N$99
  Top 0.406: SV8.2 U$1.B6
N$100
  Top 0.406: SV8.4 U$1.G15
N$101
  Top 0.406: SV8.5 U$1.G13
N$102
  Top 0.406: SV8.6 U$1.G11
N$103
  Top 0.406: SV8.7 U$1.G9
N$104
  Top 0.406: SV8.8 U$1.D6
N$105
  Top 0.406: SV8.9 U$1.D4
N$106
  Top 0.406: SV8.11 U$1.D0
N$107
  Top 0.406: SV8.14 U$1.A13
N$108
  Top 0.406: SV8.15 U$1.A11
N$109
  Top 0.406: SV8.17 U$1.C9
N$110
  Top 0.406: SV8.18 U$1.C7
N$111
  Top 0.406: SV8.19 U$1.G8
N$112
  Top 0.406: SV8.20 U$1.G6
N$114
  Top 0.406: U$1.D9 76.2,56.66 77.44,57.9 77.44,63.33 76.2,64.57 SV9.4
N$115
  Top 0.406: U$1.D11 73.66,56.66 74.91,57.9 74.91,63.33 73.66,64.57 SV9.5
N$116
  Top 0.406: U$1.D13 71.12,56.66 72.36,57.9 72.36,63.33 71.12,64.57 SV9.6
N$117
  Top 0.406: U$1.D15 68.58,56.66 69.83,57.9 69.83,63.33 68.58,64.57 SV9.7
N$118
  Top 0.406: U$1.G3 66.04,56.66 67.28,57.9 67.28,63.33 66.04,64.57 SV9.8
N$119
  Top 0.406: U$1.G5 63.5,56.66 64.75,57.9 64.75,63.33 63.5,64.57 SV9.9
N$120
  Top 0.406: U$1.G7 60.96,56.66 62.2,57.9 62.2,63.33 60.96,64.57 SV9.10
N$121
  Top 1.016: F1.2 72.39,73.15 3V3.1
NSS1
  Top 0.406: SV4.15 45.72,4.01 44.48,5.25 44.48,10.68 45.72,11.92 U$1.A4 44.94,12.7 43.7,13.95 40.66,13.95 U$2.P$9 30.48,13.97 6.35,13.97 5.08,12.7 3.94,12.7 SPI1.1
NSS2  (via drill 0.35)
  Top 0.406: v40.64,35.56 57.15,35.56 57.15,33.02 62.23,33.02 U$2.P$21 | U$1.B12 SV7.2 | SPI2.1 21.97,27.94 26.68,33.03 26.71,33.53 26.67,34.13 v26.67,35.56
  Bottom 0.406: v26.67,35.56 v40.64,35.56 | U$2.P$21 57.15,40.64 57.15,52.7 58.42,53.98 80.01,53.98 80.01,57.15 U$1.B12
NSS3
  Top 0.406: SV8.13 U$1.A15 43.18,57.64 41.94,56.4 41.94,54.82 41.33,54.21 27.8,54.21 19.31,45.72 SPI3.1
RX1
  Top 0.406: UART1.2 48.26,31.75 U$2.P$27 | U$1.A10 50.8,56.66 52.05,57.9 52.05,63.33 50.8,64.57 SV6.4
  Bottom 0.406: U$2.P$27 48.26,36.83 43.18,41.91 43.18,52.07 44.45,53.34 48.26,53.34 U$1.A10
RX2
  Top 0.406: U$1.A3 SV2.6
  Bottom 0.406: U$2.P$8 34.13,19.05 35.14,20.06 35.98,20.06 36.57,19.47 36.57,18.04 40.66,13.95 41.16,13.95 41.94,13.16 41.94,12.18 42.72,11.4 43.7,11.4 44.94,10.16 U$1.A3 46.99,8.89 91.44,8.89 UART2.2
RX3  (via drill 0.35)
  Top 0.406: U$2.P$16 55.88,16.51 78.74,16.51 U$1.B11 78.74,11.92 77.5,10.68 77.5,5.25 78.74,4.01 SV5.8 80.16,3.96 80.16,7.58 80.39,7.8 v80.39,8.16
  Bottom 0.406: v80.39,8.16 80.74,8.16 80.82,8.23 81.74,8.23 82.35,7.62 88.9,7.62 89.53,8.26 93.34,8.26 UART3.2
RX4  (via drill 0.35)
  Top 0.406: UART4.2 29.21,22.86 29.21,52.07 v39.37,52.07 | SV8.12 U$1.C11
  Bottom 0.406: U$1.C11 40.64,57.64 39.4,56.4 39.4,52.09 v39.37,52.07
RX5
  Top 0.406: SV8.10 U$1.D2
  Bottom 0.406: UART5.2 93.47,58.42 91.31,60.58 84.51,60.58 84.28,60.35 37.44,60.35 SV8.10
RX_AX
  Bottom 0.406: UART_AX.2 66.04,40.64 IC1.18
RX_XM
  Bottom 0.406: MAX485.1 90.17,50.8 R2.2 UART_XM.2
SCK1
  Top 0.406: U$1.A5 SV2.5 | U$2.P$10 36.83,20.32 13.97,20.32 10.16,16.51 5.21,16.51 SPI1.2
  Bottom 0.406: U$2.P$10 43.2,13.95 43.7,13.95 44.48,13.16 44.48,12.18 45.26,11.4 46.24,11.4 47.48,10.16 U$1.A5
SCK2  (via drill 0.35)
  Top 0.406: v40.64,36.83 58.42,36.83 U$2.P$22 | U$1.B13 81.28,56.66 82.53,57.9 82.53,63.33 81.28,64.57 SV9.2 | v59.69,53.24 55.78,53.24 54.61,52.07 v54.61,48.26 | v16.51,36.96 v16.51,31.76
  Bottom 0.406: v40.64,36.83 v16.51,36.96 | U$1.B13 81.28,53.34 63.5,53.34 63.4,53.24 v59.69,53.24 | v54.61,48.26 54.61,40.64 U$2.P$22 | v16.51,31.76 14.85,30.48 SPI2.2
SCK3
  Top 0.406: SV6.16 20.32,64.57 21.57,63.33 21.57,58.45 21.59,58.42 21.59,57.15 U$1.B3 20.3,55.59 20.28,55.15 13.05,47.91 5.43,47.91 5.08,48.26 SPI3.2
TX1  (via drill 0.35)
  Top 0.406: SV8.16 U$1.A9 50.12,57.74 50.12,57.25 49.55,56.68 49.55,55.68 49.51,55.64 49.51,55.36 46.73,52.59 42.7,52.59 36.83,46.17 36.83,29.03 36.87,29.09 42.96,29.09 v42.99,29.11
  Bottom 0.406: UART1.1 50.8,29.21 | 50.8,29.21 U$2.P$26 | 50.8,29.21 50.7,29.11 v42.99,29.11
TX2  (via drill 0.35)
  Top 0.406: U$1.A2 43.18,11.92 41.94,10.68 41.94,5.25 43.18,4.01 SV4.14 | v90.93,5.08 90.81,11.43 UART2.1
  Bottom 0.406: U$2.P$7 30.48,15.24 31.75,13.97 31.75,4.7 32.13,4.32 32.45,4.32 32.56,4.42 41.3,4.42 SV4.14 45.11,4.47 81.74,4.47 82.35,5.08 83.82,5.08 83.82,2.54 88.9,2.54 90.93,4.57 v90.93,5.08
TX3
  Top 0.406: U$1.B10 SV3.2 79.48,7.09 79.48,11.43 80.03,11.99 80.03,13.22 80.76,13.95 81.8,13.95 85.06,13.98 85.06,7.62 83.82,6.38 83.82,2.54 UART3.1
  Bottom 0.406: U$2.P$15 52.07,17.78 52.07,15.24 76.2,15.24 77.5,13.95 77.5,12.18 78.74,10.94 U$1.B10
TX4
  Top 0.406: SV6.7 43.18,64.77 44.45,63.5 44.45,57.15 U$1.C10
  Bottom 0.406: UART4.1 88.9,27.94 41.91,27.94 41.91,53.34 43.18,54.61 U$1.C10
TX5
  Top 0.406: SV6.8 40.64,64.77 41.92,63.86 41.92,57.38 U$1.C12
  Bottom 0.406: UART5.1 93.98,55.88 90.17,59.69 42.69,59.69 41.91,59.19 41.92,57.4 41.38,56.63 41.38,56.62 U$1.C12
TX_AX
  Bottom 0.406: UART_AX.1 66.04,38.1 IC1.17
TX_XM
  Bottom 0.508: MAX485.4 78.74,46.99 UART_XM.1
VCC  (via drill 0.35)
  Top 0.152: C2.1 86.77,43.18 | C1.1
  Top 0.406: IC1.20 C1.1 | MAX485.8 86.77,43.18
  Top 0.508: C2.1 94.32,50.68 94.32,61.31 94.36,61.31 96.47,63.42 96.47,71.12 v97.76,71.12
  Bottom 0.406: C1.1 73.88,45.1 81.07,45.1 82.55,43.62 MAX485.8
  Bottom 0.508: v97.76,71.12 99.06,71.12 99.06,79.12 99.05,79.11 83.43,79.11 | 83.43,79.11 78.36,71.12 66.04,71.12 5V_AX.3 33.02,70.36 33.02,68.58 27.94,68.58 25.78,70.74 R4.2 | 83.43,79.11 83.44,79.12
VIN
  Bottom 0.406: R5.2 2.54,64.64 2.54,69.85 3.81,71.12 U$6.P$2
  pour Top: 0.25,79.63 50.8,79.63 50.8,68.58 0.25,68.58

### Text on the board
tNames: GND | GND | data | GND | 12V | 12V | 12V | GND | GND | 12V | D- | D+ | 12V | 5V | 3V3 | GND | RX | TX | 3V3 | MOSI | MISO | RX | SCK | TX | NSS | GND | RX | TX | 3V3 | MOSI | 3V3 | MISO | RX | SCK | TX | NSS | LAAS_CNRS | GND | RX | 3V3 | GND | GND | TX | MOSI | MISO | SCK | RX | NSS | TX